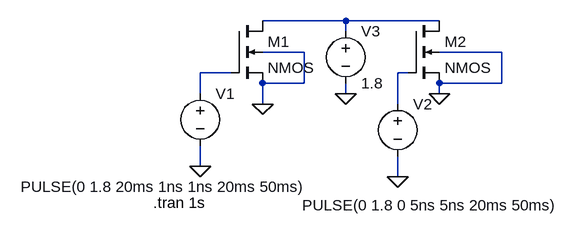
[diagram p0: schematic OR_Gate_Implementation_Using_NMOS_Switches.asc]
OR_Gate_Implementation_Using_NMOS_Switches.asc, the LTspice schematic file:
Version 4
SHEET 1 1580 976
WIRE 224 64 96 64
WIRE 368 64 224 64
WIRE 224 80 224 64
WIRE 160 112 96 112
WIRE 464 112 368 112
WIRE 48 144 0 144
WIRE 320 144 304 144
WIRE 160 160 160 112
WIRE 160 160 96 160
WIRE 464 160 464 112
WIRE 464 160 368 160
WIRE 0 176 0 144
WIRE 224 176 224 160
WIRE 368 176 368 160
WIRE 96 192 96 160
WIRE 304 192 304 144
WIRE 0 288 0 256
WIRE 304 304 304 272
FLAG 0 288 0
FLAG 304 304 0
FLAG 368 176 0
FLAG 224 176 0
FLAG 96 192 0
SYMBOL nmos4 48 64 R0
SYMATTR InstName M1
SYMBOL nmos4 320 64 R0
SYMATTR InstName M2
SYMBOL voltage 0 160 R0
WINDOW 3 -276 159 Left 2
WINDOW 123 0 0 Left 0
WINDOW 39 0 0 Left 0
SYMATTR Value PULSE(0 1.8 20ms 1ns 1ns 20ms 50ms)
SYMATTR InstName V1
SYMBOL voltage 304 176 R0
WINDOW 123 0 0 Left 0
WINDOW 39 0 0 Left 0
WINDOW 3 -147 172 Left 2
SYMATTR Value PULSE(0 1.8 0 5ns 5ns 20ms 50ms)
SYMATTR InstName V2
SYMBOL voltage 224 64 R0
WINDOW 123 0 0 Left 0
WINDOW 39 0 0 Left 0
SYMATTR InstName V3
SYMATTR Value 1.8
TEXT -72 344 Left 2 !.tran 1s

The netlist it stands for:
* OR_Gate_Implementation_Using_NMOS_Switches.asc
M1 N001 N002 0 0 NMOS
M2 N001 N003 0 0 NMOS
V1 N002 0 PULSE(0 1.8 20ms 1ns 1ns 20ms 50ms)
V2 N003 0 PULSE(0 1.8 0 5ns 5ns 20ms 50ms)
V3 N001 0 1.8
.model NMOS NMOS
.model PMOS PMOS
.lib standard.mos
.tran 1s
.backanno
.end